# Altium schematic sheet FPGA_OUTPUTS.SchDoc
size A4; SheetNumber: 4; SheetTotal: 9
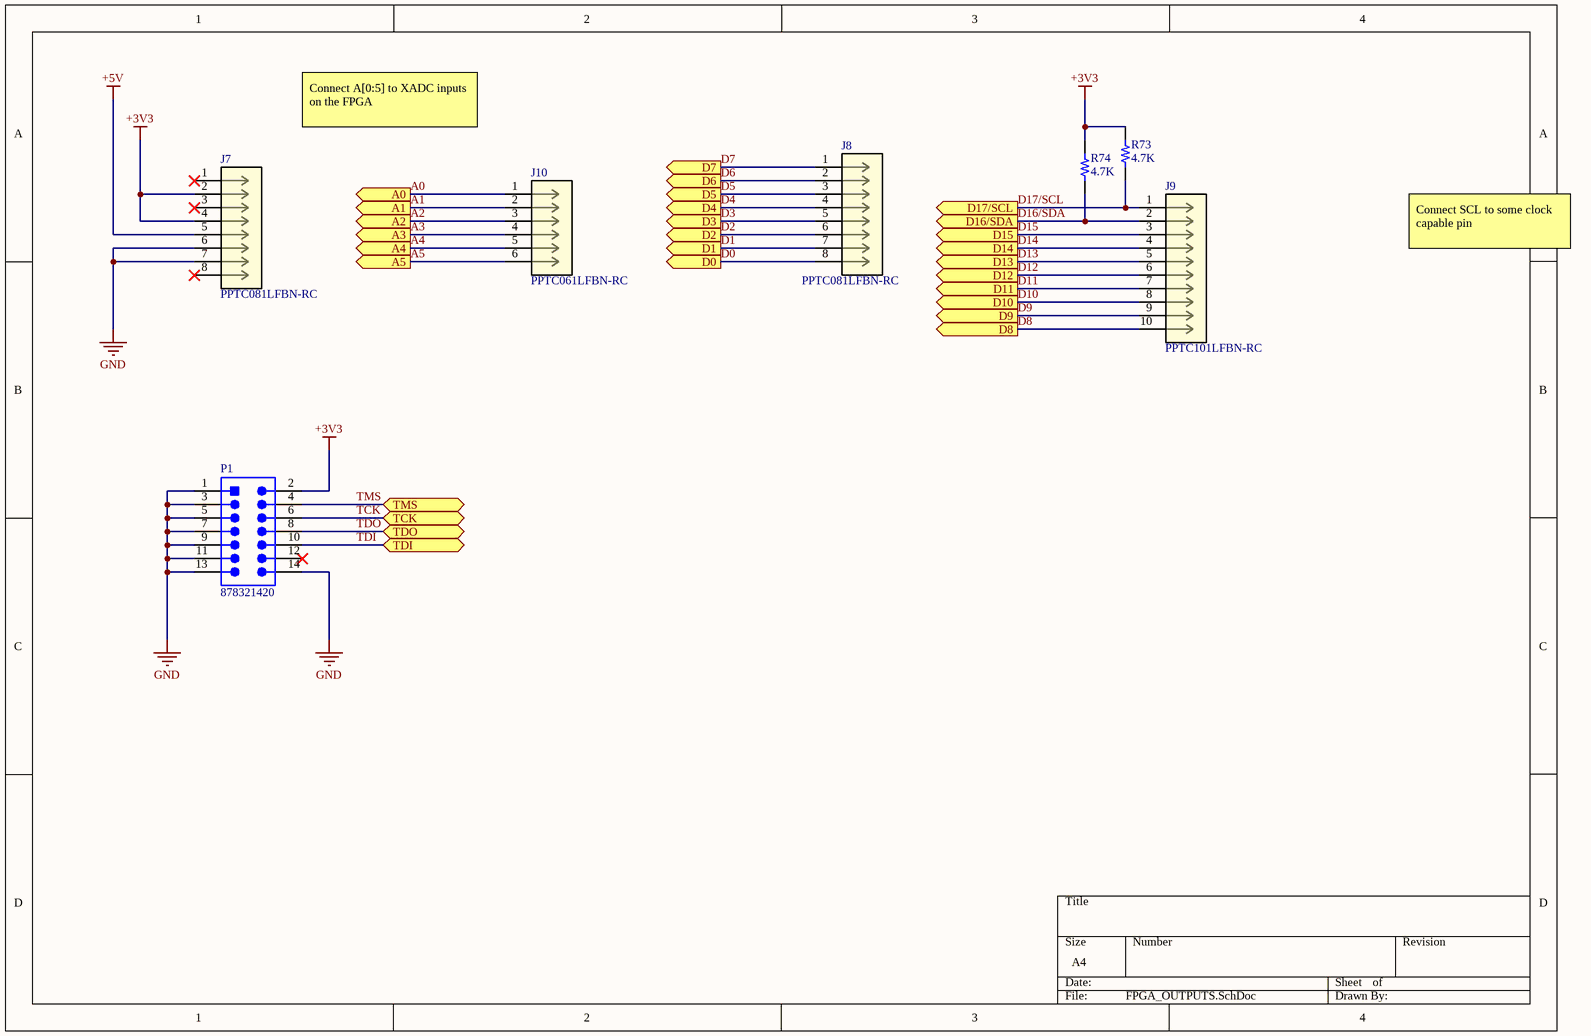
[diagram p0: FPGA_OUTPUTS.SchDoc]

## Parts
J7  PPTC081LFBN-RC  [CONN_PPTC081LFBN-RC_SUL]
J8  PPTC081LFBN-RC  [CONN_PPTC081LFBN-RC_SUL]
J9  PPTC101LFBN-RC  [CONN10_101LFBN-RC_SUL]
J10  PPTC061LFBN-RC  [SULLINS_PPTC061LFBN-RC]
P1  878321420  [MOLX-878321420_V]
R73  4.7K  [RES 0603_1608]
R74  4.7K  [RES 0603_1608]

## Ports
A0 (out), A1 (out), A2 (out), A3 (out), A4 (out), A5 (out), D0 (out), D1 (out), D2 (out), D3 (out), D4 (out), D5 (out), D6 (out), D7 (out), D8 (out), D9 (out), D10 (out), D11 (out), D12 (out), D13 (out), D14 (out), D15 (out), D16/SDA (out), D17/SCL (out), TCK (bidir), TDI (bidir), TDO (bidir), TMS (bidir)

## Nets
+3V3: J7.2 J7.4 P1.2 R73.2 R74.2
+5V: J7.5
GND: J7.6 J7.7 P1.1 P1.3 P1.5 P1.7 P1.9 P1.11 P1.13 P1.14
A0: J10.1 ; port A0
A1: J10.2 ; port A1
A2: J10.3 ; port A2
A3: J10.4 ; port A3
A4: J10.5 ; port A4
A5: J10.6 ; port A5
D0: J8.8 ; port D0
D1: J8.7 ; port D1
D2: J8.6 ; port D2
D3: J8.5 ; port D3
D4: J8.4 ; port D4
D5: J8.3 ; port D5
D6: J8.2 ; port D6
D7: J8.1 ; port D7
D8: J9.10 ; port D8
D9: J9.9 ; port D9
D10: J9.8 ; port D10
D11: J9.7 ; port D11
D12: J9.6 ; port D12
D13: J9.5 ; port D13
D14: J9.4 ; port D14
D15: J9.3 ; port D15
D16/SDA: J9.2 R74.1 ; port D16/SDA
D17/SCL: J9.1 R73.1 ; port D17/SCL
TCK: P1.6 ; port TCK
TDI: P1.10 ; port TDI
TDO: P1.8 ; port TDO
TMS: P1.4 ; port TMS

Not connected (* = marked no-connect by the designer): J7 1* 3* 8*; P1 12*

## Notes on the sheet
- Connect A[0:5] to XADC inputs on the FPGA
- Connect SCL to some clock capable pin

## Library data of the parts
J7 J8 = PPTC081LFBN-RC: No Description Available; Mfr_Name: Sullins; RefDes: RefDes; Type: Type
J9 = PPTC101LFBN-RC: No Description Available; Mfr_Name: Sullins; RefDes: RefDes; Type: Type
J10 = PPTC061LFBN-RC: 6 Position Header Connector 0.100 (2.54mm) Through Hole Tin; MF: Sullins Connector; SnapEDA_Link: https://www.snapeda.com/parts/PPTC061LFBN-RC/Sullins+Connector+Solutions/view-part/?ref=snap; Package: None; Value: *; MP: PPTC061LFBN-RC; Check_prices: https://www.snapeda.com/parts/PPTC061LFBN-RC/Sullins+Connector+Solutions/view-part/?ref=eda
P1 = CMP-2000-05520-1: Male Header, Pitch 2 mm, 2 x 7 Position, Height 7.6 mm, -55 to 105 degC, RoHS; Manufacturer: Molex; Datasheet URL: http://www.molex.com/pdm_docs/sd/878321420_sd.pdf; Package Description: Male Header, Pitch 2 mm, 2 x 7 Positions, Height 7.6 mm; Manufacturer URL: http://www.molex.com/; Package Reference: 878321420; Datasheet Version: Rev. G, 01/2012; Mounting Technology: SurfaceMount
R73 R74 = CMP-010-0075-8: Fixed Resistor, Metal Glaze/thick Film, 0.1W, 4700ohm, 75V, 1% +/-Tol, 100ppm/Cel, Surface Mount, 0603; Temperature Coefficient: 100ppm/°C; Case/Package: 0603; Voltage Rating: 75V